# EAGLE schematic ControlBoardv1.3 (EAGLE 7.6.0)

## Sheet 1 of 6
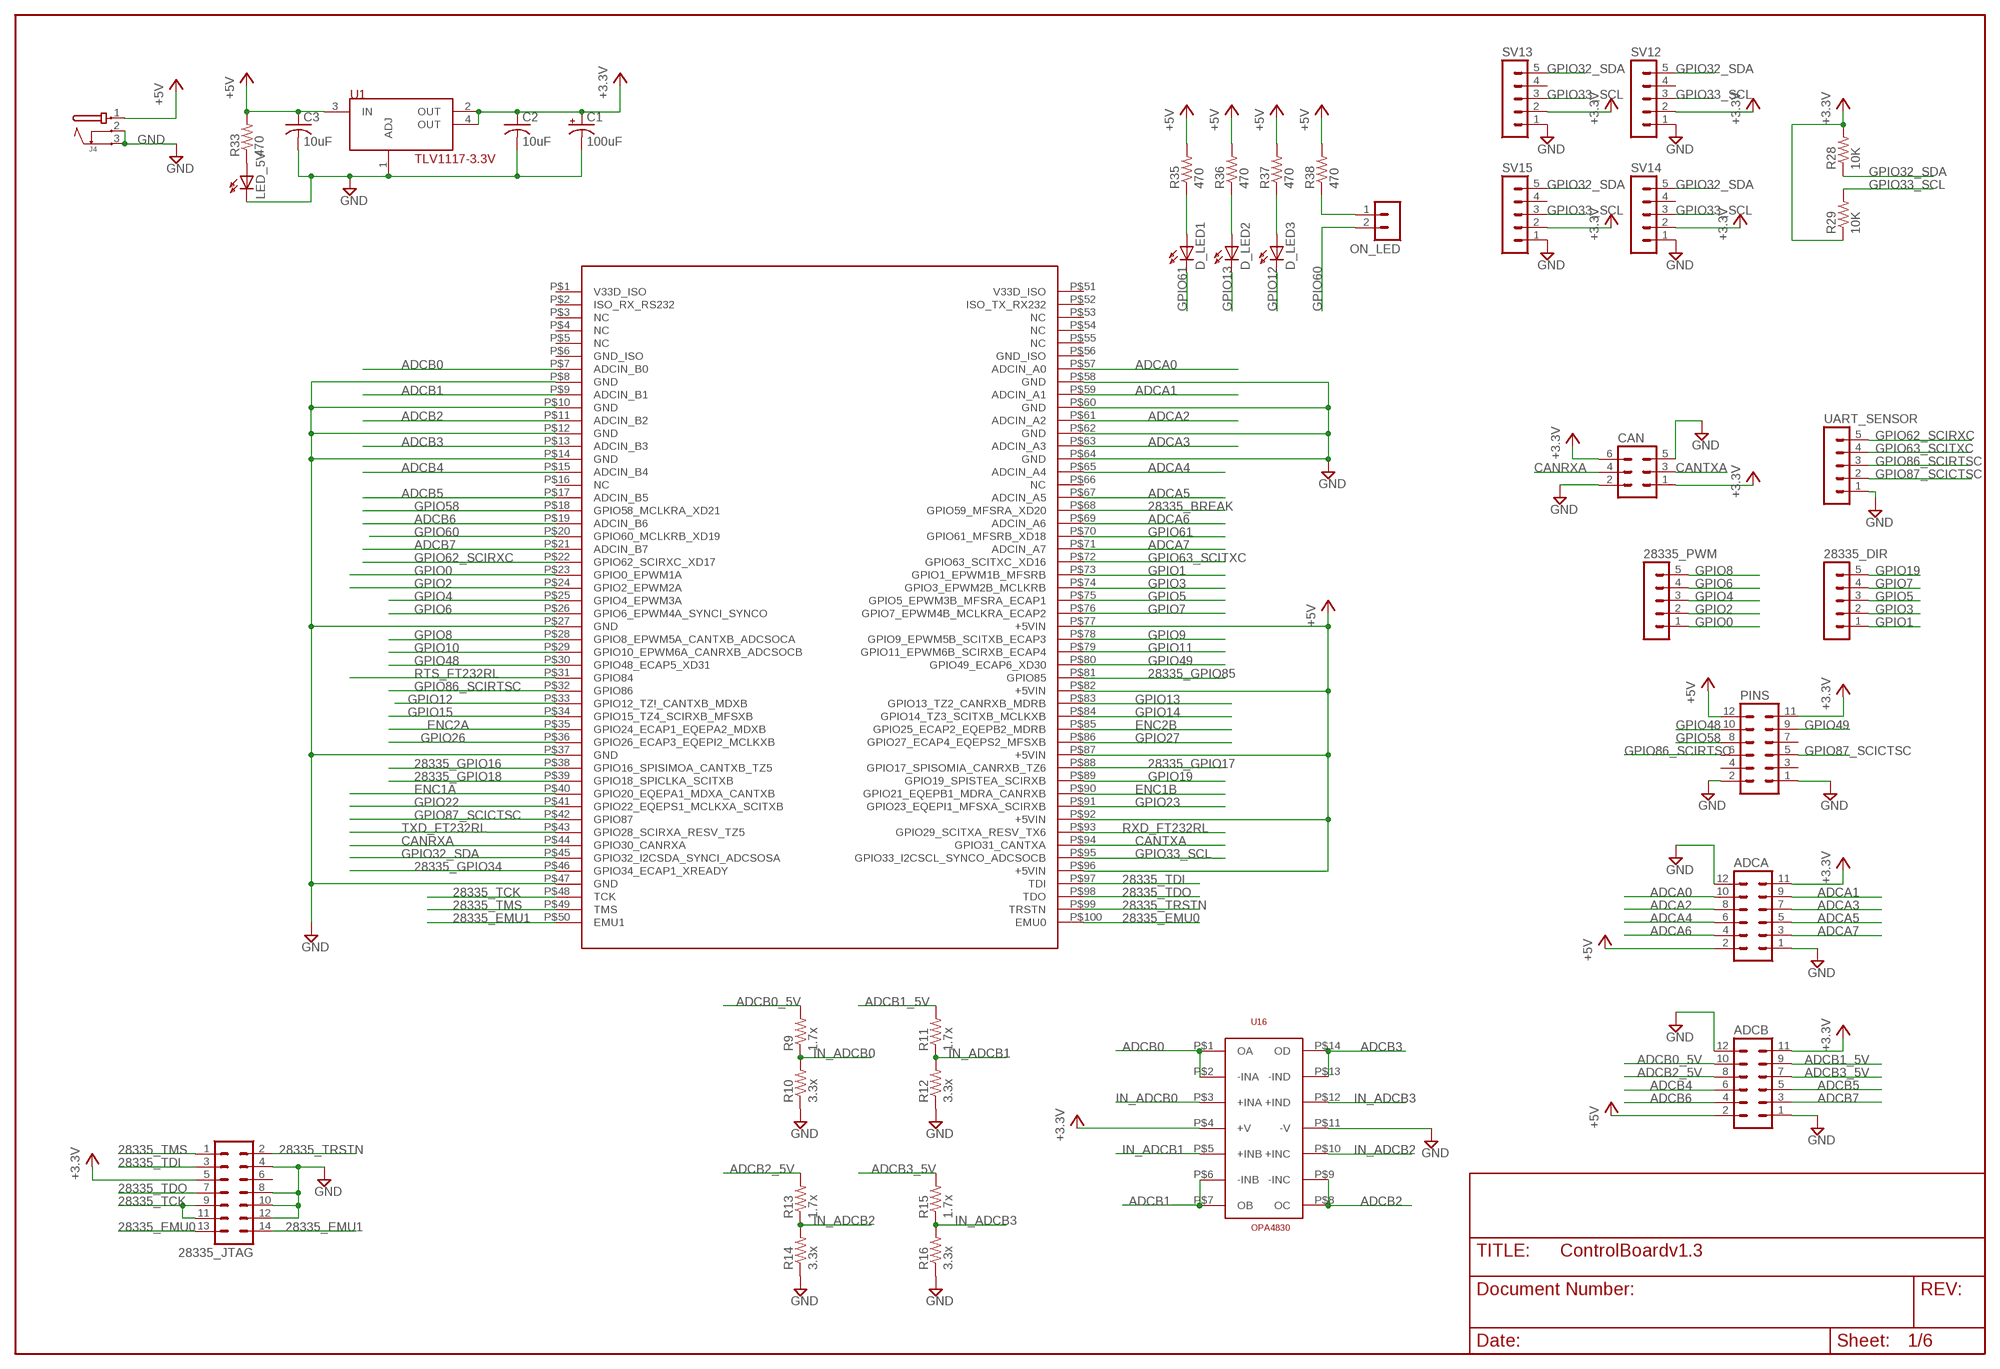
[diagram p0: schematic, sheet 1]

### Parts
28335_DIR  MA05-1  [MA05-1]
28335_JTAG  MA07-2  [MA07-2]
28335_PWM  MA05-1  [MA05-1]
ADCA  MA06-2  [MA06-2]
ADCB  MA06-2  [MA06-2]
C1  100uF  CPOL-USE3.5-8  [E3,5-8]
C2  10uF  C-USC1206  [C1206]
C3  10uF  C-USC1206  [C1206]
CAN  MA03-2  [MA03-2]
D_LED1  LED3MM  [LED3MM]
D_LED2  LED3MM  [LED3MM]
D_LED3  LED3MM  [LED3MM]
J4  JACK-PMS  [JACK-PMS]
J7  F28335_CONTROLCARD  [MOLEX_DIMM_100]
LED_5V  LED3MM  [LED3MM]
ON_LED  MA02-1  [MA02-1]
PINS  MA06-2  [MA06-2]
R9  1.7x  R-US_M1206  [M1206]
R10  3.3x  R-US_M1206  [M1206]
R11  1.7x  R-US_M1206  [M1206]
R12  3.3x  R-US_M1206  [M1206]
R13  1.7x  R-US_M1206  [M1206]
R14  3.3x  R-US_M1206  [M1206]
R15  1.7x  R-US_M1206  [M1206]
R16  3.3x  R-US_M1206  [M1206]
R28  10K  R-US_M1206  [M1206]
R29  10K  R-US_M1206  [M1206]
R33  470  R-US_M1206  [M1206]
R35  470  R-US_M1206  [M1206]
R36  470  R-US_M1206  [M1206]
R37  470  R-US_M1206  [M1206]
R38  470  R-US_M1206  [M1206]
SV12  MA05-1  [MA05-1]
SV13  MA05-1  [MA05-1]
SV14  MA05-1  [MA05-1]
SV15  MA05-1  [MA05-1]
U1  TLV1117-3.3V  TLV1117-ADJ  [SOT223]
U16  OPA4830  [OPA4830-TSSOP-14]
UART_SENSOR  MA05-1  [MA05-1]

### Nets
28335_BREAK: J7.P$68(GPIO59_MFSRA_XD20) ; also sheet 6
28335_EMU0: 28335_JTAG.13 J7.P$100(EMU0)
28335_EMU1: 28335_JTAG.14 J7.P$50(EMU1)
28335_GPIO16: J7.P$38(GPIO16_SPISIMOA_CANTXB_TZ5) ; also sheet 2,5
28335_GPIO17: J7.P$88(GPIO17_SPISOMIA_CANRXB_TZ6) ; also sheet 2,5
28335_GPIO18: J7.P$39(GPIO18_SPICLKA_SCITXB) ; also sheet 2,5
28335_GPIO34: J7.P$46(GPIO34_ECAP1_XREADY)
28335_GPIO85: J7.P$81(GPIO85) ; also sheet 2
28335_TCK: 28335_JTAG.9 28335_JTAG.11 J7.P$48(TCK)
28335_TDI: 28335_JTAG.3 J7.P$97(TDI)
28335_TDO: 28335_JTAG.7 J7.P$98(TDO)
28335_TMS: 28335_JTAG.1 J7.P$49(TMS)
28335_TRSTN: 28335_JTAG.2 J7.P$99(TRSTN)
+3.3V [supply]: 28335_JTAG.5 ADCA.11 ADCB.11 C1.+ C2.1 CAN.1 CAN.6 PINS.11 R28.2 R29.1 SV12.2 SV13.2 SV14.2 SV15.2 U1.2(OUT) U1.4(OUT) U16.P$4(+V) ; also sheet 2,4,5
+5V [supply]: ADCA.2 ADCB.2 C3.1 J4.1 J7.P$77(+5VIN) J7.P$82(+5VIN) J7.P$87(+5VIN) J7.P$92(+5VIN) J7.P$96(+5VIN) PINS.12 R33.2 R35.2 R36.2 R37.2 R38.2 U1.3(IN) ; also sheet 2,5,6
ADCA0: ADCA.10 J7.P$57(ADCIN_A0)
ADCA1: ADCA.9 J7.P$59(ADCIN_A1)
ADCA2: ADCA.8 J7.P$61(ADCIN_A2)
ADCA3: ADCA.7 J7.P$63(ADCIN_A3)
ADCA4: ADCA.6 J7.P$65(ADCIN_A4)
ADCA5: ADCA.5 J7.P$67(ADCIN_A5)
ADCA6: ADCA.4 J7.P$69(ADCIN_A6)
ADCA7: ADCA.3 J7.P$71(ADCIN_A7)
ADCB0: J7.P$7(ADCIN_B0) U16.P$1(OA) U16.P$2(-INA)
ADCB0_5V: ADCB.10 R9.2
ADCB1: J7.P$9(ADCIN_B1) U16.P$6(-INB) U16.P$7(OB)
ADCB1_5V: ADCB.9 R11.2
ADCB2: J7.P$11(ADCIN_B2) U16.P$8(OC) U16.P$9(-INC)
ADCB2_5V: ADCB.8 R13.2
ADCB3: J7.P$13(ADCIN_B3) U16.P$13(-IND) U16.P$14(OD)
ADCB3_5V: ADCB.7 R15.2
ADCB4: ADCB.6 J7.P$15(ADCIN_B4)
ADCB5: ADCB.5 J7.P$17(ADCIN_B5)
ADCB6: ADCB.4 J7.P$19(ADCIN_B6)
ADCB7: ADCB.3 J7.P$21(ADCIN_B7)
CANRXA: CAN.4 J7.P$44(GPIO30_CANRXA)
CANTXA: CAN.3 J7.P$94(GPIO31_CANTXA)
ENC1A: J7.P$40(GPIO20_EQEPA1_MDXA_CANTXB) ; also sheet 5
ENC1B: J7.P$90(GPIO21_EQEPB1_MDRA_CANRXB) ; also sheet 5
ENC2A: J7.P$35(GPIO24_ECAP1_EQEPA2_MDXB) ; also sheet 5
ENC2B: J7.P$85(GPIO25_ECAP2_EQEPB2_MDRB) ; also sheet 5
GND [supply]: 28335_JTAG.4 28335_JTAG.8 28335_JTAG.10 28335_JTAG.12 ADCA.1 ADCA.12 ADCB.1 ADCB.12 C1.- C2.2 C3.2 CAN.2 CAN.5 J4.2 J4.3 J7.P$8(GND) J7.P$10(GND) J7.P$12(GND) J7.P$14(GND) J7.P$27(GND) J7.P$37(GND) J7.P$47(GND) J7.P$58(GND) J7.P$60(GND) J7.P$62(GND) J7.P$64(GND) LED_5V.K(C) PINS.1 PINS.2 R10.1 R12.1 R14.1 R16.1 SV12.1 SV13.1 SV14.1 SV15.1 U1.1(ADJ) U16.P$11(-V) UART_SENSOR.1 ; also sheet 2,3,4,5,6
GPIO0: 28335_PWM.1 J7.P$23(GPIO0_EPWM1A)
GPIO1: 28335_DIR.1 J7.P$73(GPIO1_EPWM1B_MFSRB)
GPIO2: 28335_PWM.2 J7.P$24(GPIO2_EPWM2A)
GPIO3: 28335_DIR.2 J7.P$74(GPIO3_EPWM2B_MCLKRB)
GPIO4: 28335_PWM.3 J7.P$25(GPIO4_EPWM3A)
GPIO5: 28335_DIR.3 J7.P$75(GPIO5_EPWM3B_MFSRA_ECAP1)
GPIO6: 28335_PWM.4 J7.P$26(GPIO6_EPWM4A_SYNCI_SYNCO)
GPIO7: 28335_DIR.4 J7.P$76(GPIO7_EPWM4B_MCLKRA_ECAP2)
GPIO8: 28335_PWM.5 J7.P$28(GPIO8_EPWM5A_CANTXB_ADCSOCA)
GPIO9: J7.P$78(GPIO9_EPWM5B_SCITXB_ECAP3) ; also sheet 5
GPIO10: J7.P$29(GPIO10_EPWM6A_CANRXB_ADCSOCB) ; also sheet 5
GPIO11: J7.P$79(GPIO11_EPWM6B_SCIRXB_ECAP4) ; also sheet 5
GPIO12: D_LED3.K(C) J7.P$33(GPIO12_TZ\!_CANTXB_MDXB)
GPIO13: D_LED2.K(C) J7.P$83(GPIO13_TZ2_CANRXB_MDRB)
GPIO14: J7.P$84(GPIO14_TZ3_SCITXB_MCLKXB) ; also sheet 4
GPIO15: J7.P$34(GPIO15_TZ4_SCIRXB_MFSXB) ; also sheet 4
GPIO19: 28335_DIR.5 J7.P$89(GPIO19_SPISTEA_SCIRXB)
GPIO22: J7.P$41(GPIO22_EQEPS1_MCLKXA_SCITXB) ; also sheet 5
GPIO23: J7.P$91(GPIO23_EQEPI1_MFSXA_SCIRXB) ; also sheet 5
GPIO26: J7.P$36(GPIO26_ECAP3_EQEPI2_MCLKXB) ; also sheet 5
GPIO27: J7.P$86(GPIO27_ECAP4_EQEPS2_MFSXB) ; also sheet 5
GPIO32_SDA: J7.P$45(GPIO32_I2CSDA_SYNCI_ADCSOSA) R28.1 SV12.5 SV13.5 SV14.5 SV15.5
GPIO33_SCL: J7.P$95(GPIO33_I2CSCL_SYNCO_ADCSOCB) R29.2 SV12.3 SV13.3 SV14.3 SV15.3
GPIO48: J7.P$30(GPIO48_ECAP5_XD31) PINS.10
GPIO49: J7.P$80(GPIO49_ECAP6_XD30) PINS.9
GPIO58: J7.P$18(GPIO58_MCLKRA_XD21) PINS.8
GPIO60: J7.P$20(GPIO60_MCLKRB_XD19) ON_LED.2
GPIO61: D_LED1.K(C) J7.P$70(GPIO61_MFSRB_XD18)
GPIO62_SCIRXC: J7.P$22(GPIO62_SCIRXC_XD17) UART_SENSOR.5 ; also sheet 4
GPIO63_SCITXC: J7.P$72(GPIO63_SCITXC_XD16) UART_SENSOR.4 ; also sheet 4
GPIO86_SCIRTSC: J7.P$32(GPIO86) PINS.6 UART_SENSOR.3 ; also sheet 4
GPIO87_SCICTSC: J7.P$42(GPIO87) PINS.5 UART_SENSOR.2 ; also sheet 4
IN_ADCB0: R9.1 R10.2 U16.P$3(+INA)
IN_ADCB1: R11.1 R12.2 U16.P$5(+INB)
IN_ADCB2: R13.1 R14.2 U16.P$10(+INC)
IN_ADCB3: R15.1 R16.2 U16.P$12(+IND)
N$57: LED_5V.A R33.1
N$58: D_LED1.A R35.1
N$59: D_LED2.A R36.1
N$60: D_LED3.A R37.1
N$61: ON_LED.1 R38.1
RTS_FT232RL: J7.P$31(GPIO84) ; also sheet 3
RXD_FT232RL: J7.P$93(GPIO29_SCITXA_RESV_TX6) ; also sheet 3
TXD_FT232RL: J7.P$43(GPIO28_SCIRXA_RESV_TZ5) ; also sheet 3
Unconnected: 28335_JTAG.6 J7.P$1(V33D_ISO) J7.P$2(ISO_RX_RS232) J7.P$3(NC) J7.P$4(NC) J7.P$5(NC) J7.P$6(GND_ISO) J7.P$16(NC) J7.P$51(V33D_ISO) J7.P$52(ISO_TX_RX232) J7.P$53(NC) J7.P$54(NC) J7.P$55(NC) J7.P$56(GND_ISO) J7.P$66(NC) PINS.3 PINS.4 PINS.7 SV12.4 SV13.4 SV14.4 SV15.4

## Sheet 2 of 6
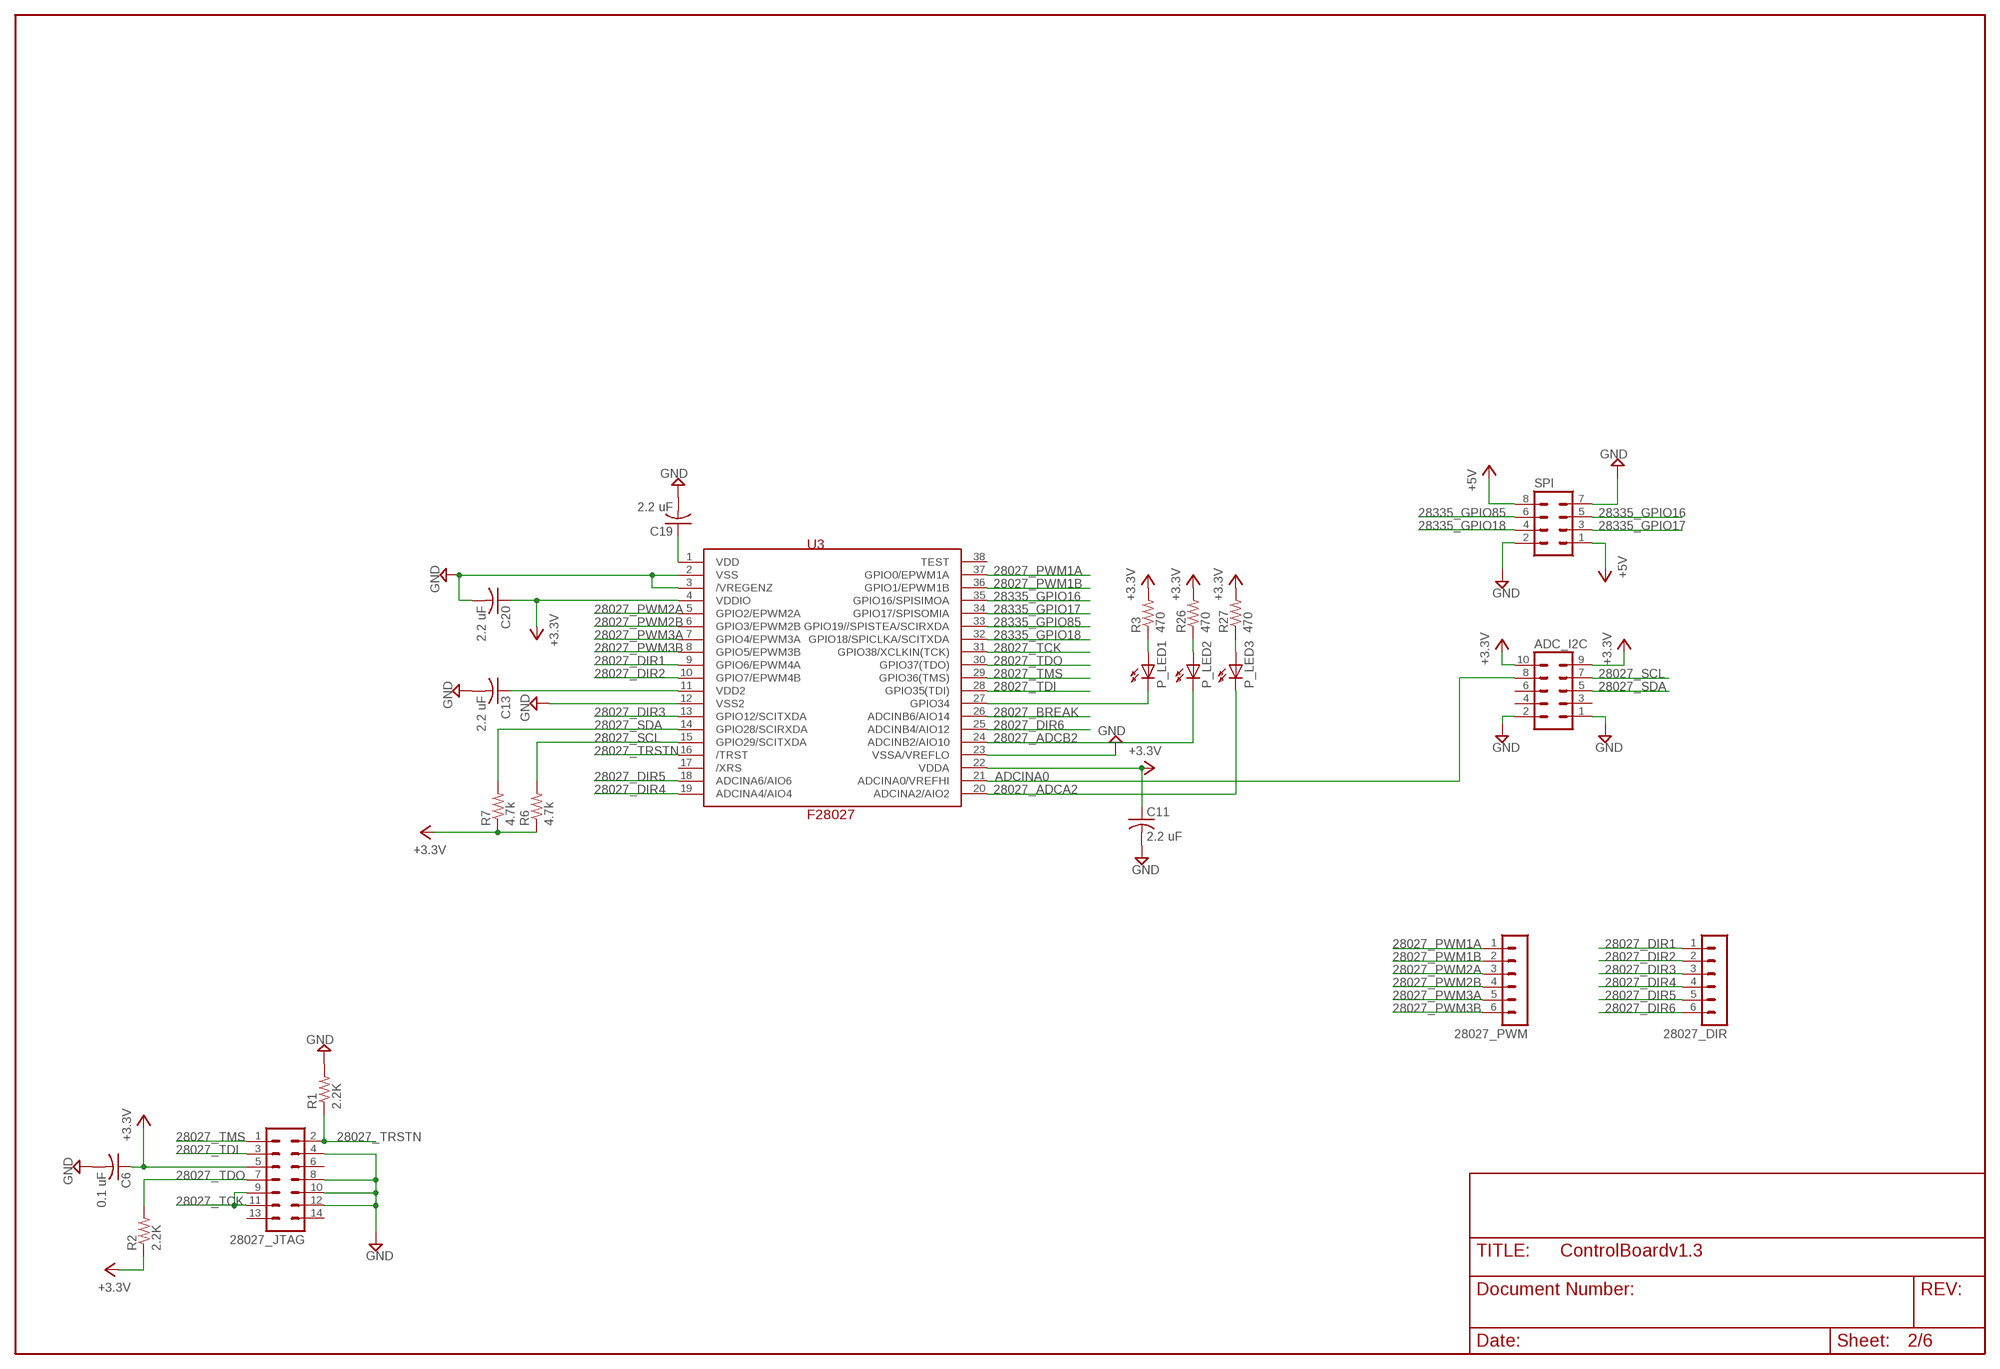
[diagram p1: schematic, sheet 2]

### Parts
28027_DIR  MA06-1  [MA06-1]
28027_JTAG  MA07-2  [MA07-2]
28027_PWM  MA06-1  [MA06-1]
ADC_I2C  MA05-2  [MA05-2]
C6  0.1 uF  C-USC1206  [C1206]
C11  2.2 uF  C-USC1206  [C1206]
C13  2.2 uF  C-USC1206  [C1206]
C19  2.2 uF  C-USC1206  [C1206]
C20  2.2 uF  C-USC1206  [C1206]
P_LED1  LED3MM  [LED3MM]
P_LED2  LED3MM  [LED3MM]
P_LED3  LED3MM  [LED3MM]
R1  2.2K  R-US_M1206  [M1206]
R2  2.2K  R-US_M1206  [M1206]
R3  470  R-US_M1206  [M1206]
R6  4.7k  R-US_M1206  [M1206]
R7  4.7k  R-US_M1206  [M1206]
R26  470  R-US_M1206  [M1206]
R27  470  R-US_M1206  [M1206]
SPI  MA04-2  [MA04-2]
U3  F28027  TMS320F28027DAS  [DA38]

### Nets
28027_ADCA2: P_LED3.K(C) U3.20(ADCINA2/AIO2)
28027_ADCB2: P_LED2.K(C) U3.24(ADCINB2/AIO10)
28027_BREAK: U3.26(ADCINB6/AIO14) ; also sheet 6
28027_DIR1: 28027_DIR.1 U3.9(GPIO6/EPWM4A)
28027_DIR2: 28027_DIR.2 U3.10(GPIO7/EPWM4B)
28027_DIR3: 28027_DIR.3 U3.13(GPIO12/SCITXDA)
28027_DIR4: 28027_DIR.4 U3.19(ADCINA4/AIO4)
28027_DIR5: 28027_DIR.5 U3.18(ADCINA6/AIO6)
28027_DIR6: 28027_DIR.6 U3.25(ADCINB4/AIO12)
28027_GPIO34: P_LED1.K(C) U3.27(GPIO34)
28027_PWM1A: 28027_PWM.1 U3.37(GPIO0/EPWM1A)
28027_PWM1B: 28027_PWM.2 U3.36(GPIO1/EPWM1B)
28027_PWM2A: 28027_PWM.3 U3.5(GPIO2/EPWM2A)
28027_PWM2B: 28027_PWM.4 U3.6(GPIO3/EPWM2B)
28027_PWM3A: 28027_PWM.5 U3.7(GPIO4/EPWM3A)
28027_PWM3B: 28027_PWM.6 U3.8(GPIO5/EPWM3B)
28027_SCL: ADC_I2C.7 R6.2 U3.15(GPIO29/SCITXDA)
28027_SDA: ADC_I2C.5 R7.2 U3.14(GPIO28/SCIRXDA)
28027_TCK: 28027_JTAG.9 28027_JTAG.11 U3.31(GPIO38/XCLKIN(TCK))
28027_TDI: 28027_JTAG.3 U3.28(GPIO35(TDI))
28027_TDO: 28027_JTAG.7 R2.2 U3.30(GPIO37(TDO))
28027_TMS: 28027_JTAG.1 U3.29(GPIO36(TMS))
28027_TRSTN: 28027_JTAG.2 R1.1 U3.16(/TRST)
28335_GPIO16: SPI.5 U3.35(GPIO16/SPISIMOA) ; also sheet 1,5
28335_GPIO17: SPI.3 U3.34(GPIO17/SPISOMIA) ; also sheet 1,5
28335_GPIO18: SPI.4 U3.32(GPIO18/SPICLKA/SCITXDA) ; also sheet 1,5
28335_GPIO85: SPI.6 U3.33(GPIO19//SPISTEA/SCIRXDA) ; also sheet 1
+3.3V [supply]: 28027_JTAG.5 ADC_I2C.9 ADC_I2C.10 C6.1 C11.1 C20.1 R2.1 R3.2 R6.1 R7.1 R26.2 R27.2 U3.4(VDDIO) U3.22(VDDA) ; also sheet 1,4,5
+5V [supply]: SPI.1 SPI.8 ; also sheet 1,5,6
ADCINA0: ADC_I2C.8 U3.21(ADCINA0/VREFHI)
GND [supply]: 28027_JTAG.4 28027_JTAG.8 28027_JTAG.10 28027_JTAG.12 ADC_I2C.1 ADC_I2C.2 C6.2 C11.2 C13.2 C19.2 C20.2 R1.2 SPI.2 SPI.7 U3.2(VSS) U3.3(/VREGENZ) U3.12(VSS2) U3.23(VSSA/VREFLO) ; also sheet 1,3,4,5,6
N$16: C19.1 U3.1(VDD)
N$17: C13.1 U3.11(VDD2)
N$18: P_LED1.A R3.1
N$35: P_LED2.A R26.1
N$37: P_LED3.A R27.1
Unconnected: 28027_JTAG.6 28027_JTAG.13 28027_JTAG.14 ADC_I2C.3 ADC_I2C.4 ADC_I2C.6 U3.17(/XRS) U3.38(TEST)

## Sheet 3 of 6
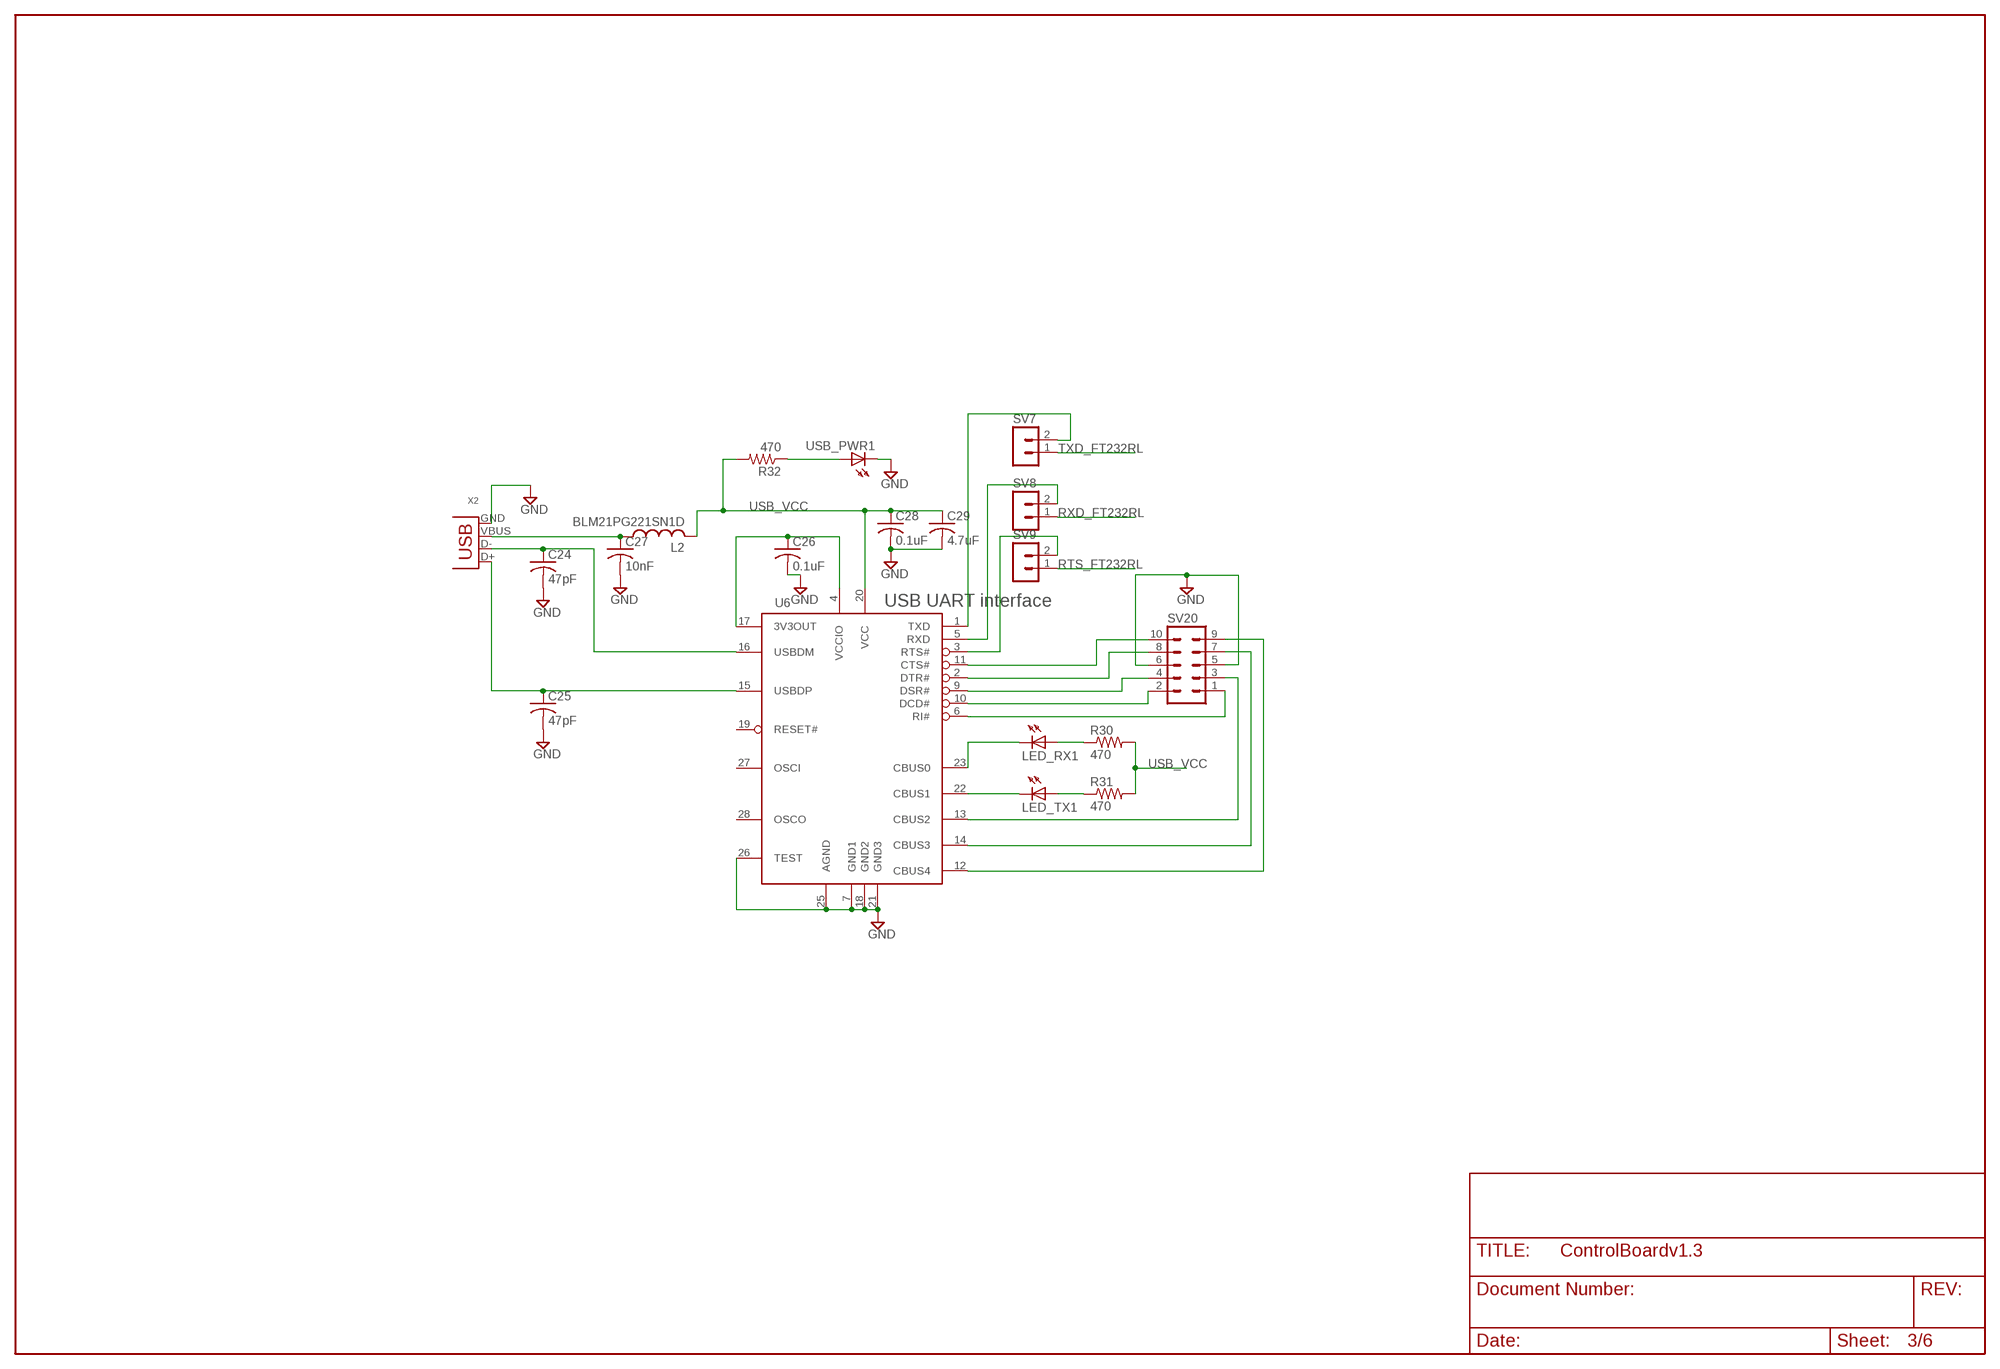
[diagram p2: schematic, sheet 3]

### Parts
C24  47pF  C-USC1206  [C1206]
C25  47pF  C-USC1206  [C1206]
C26  0.1uF  C-USC1206  [C1206]
C27  10nF  C-USC1206  [C1206]
C28  0.1uF  C-USC1206  [C1206]
C29  4.7uF  C-USC1206  [C1206]
L2  BLM21PG221SN1D  L-USL0805  [L0805]
LED_RX1  LED3MM  [LED3MM]
LED_TX1  LED3MM  [LED3MM]
R30  470  R-US_M1206  [M1206]
R31  470  R-US_M1206  [M1206]
R32  470  R-US_M1206  [M1206]
SV7  MA02-1  [MA02-1]
SV8  MA02-1  [MA02-1]
SV9  MA02-1  [MA02-1]
SV20  MA05-2  [MA05-2]
U6  FT232RL  [SSOP28DB]
USB_PWR1  LED3MM  [LED3MM]
X2  USB-B-H  [USB-B-H]

### Nets
GND [supply]: C24.2 C25.2 C26.2 C27.2 C28.2 C29.2 SV20.5 SV20.6 U6.7(GND1) U6.18(GND2) U6.21(GND3) U6.25(AGND) U6.26(TEST) USB_PWR1.K(C) X2.GND ; also sheet 1,2,4,5,6
N$25: SV7.2 U6.1(TXD)
N$31: SV8.2 U6.5(RXD)
N$33: SV9.2 U6.3(RTS#)
N$39 [supply]: C27.1 L2.1 X2.VBUS
N$40: C24.1 U6.16(USBDM) X2.D-
N$41: C25.1 U6.15(USBDP) X2.D+
N$42: C26.1 U6.4(VCCIO) U6.17(3V3OUT)
N$43: LED_TX1.K(C) U6.22(CBUS1)
N$44: LED_RX1.K(C) U6.23(CBUS0)
N$45: LED_RX1.A R30.1
N$46: LED_TX1.A R31.1
N$47: SV20.10 U6.11(CTS#)
N$48: SV20.8 U6.2(DTR#)
N$49: SV20.4 U6.9(DSR#)
N$50: SV20.2 U6.10(DCD#)
N$51: SV20.1 U6.6(RI#)
N$52: SV20.3 U6.13(CBUS2)
N$53: SV20.7 U6.14(CBUS3)
N$54: SV20.9 U6.12(CBUS4)
N$55: R32.1 USB_PWR1.A
RTS_FT232RL: SV9.1 ; also sheet 1
RXD_FT232RL: SV8.1 ; also sheet 1
TXD_FT232RL: SV7.1 ; also sheet 1
USB_VCC [supply]: C28.1 C29.1 L2.2 R30.2 R31.2 R32.2 U6.20(VCC)
Unconnected: U6.19(RESET#) U6.27(OSCI) U6.28(OSCO)

### Notes on the sheet
- USB UART interface

## Sheet 4 of 6
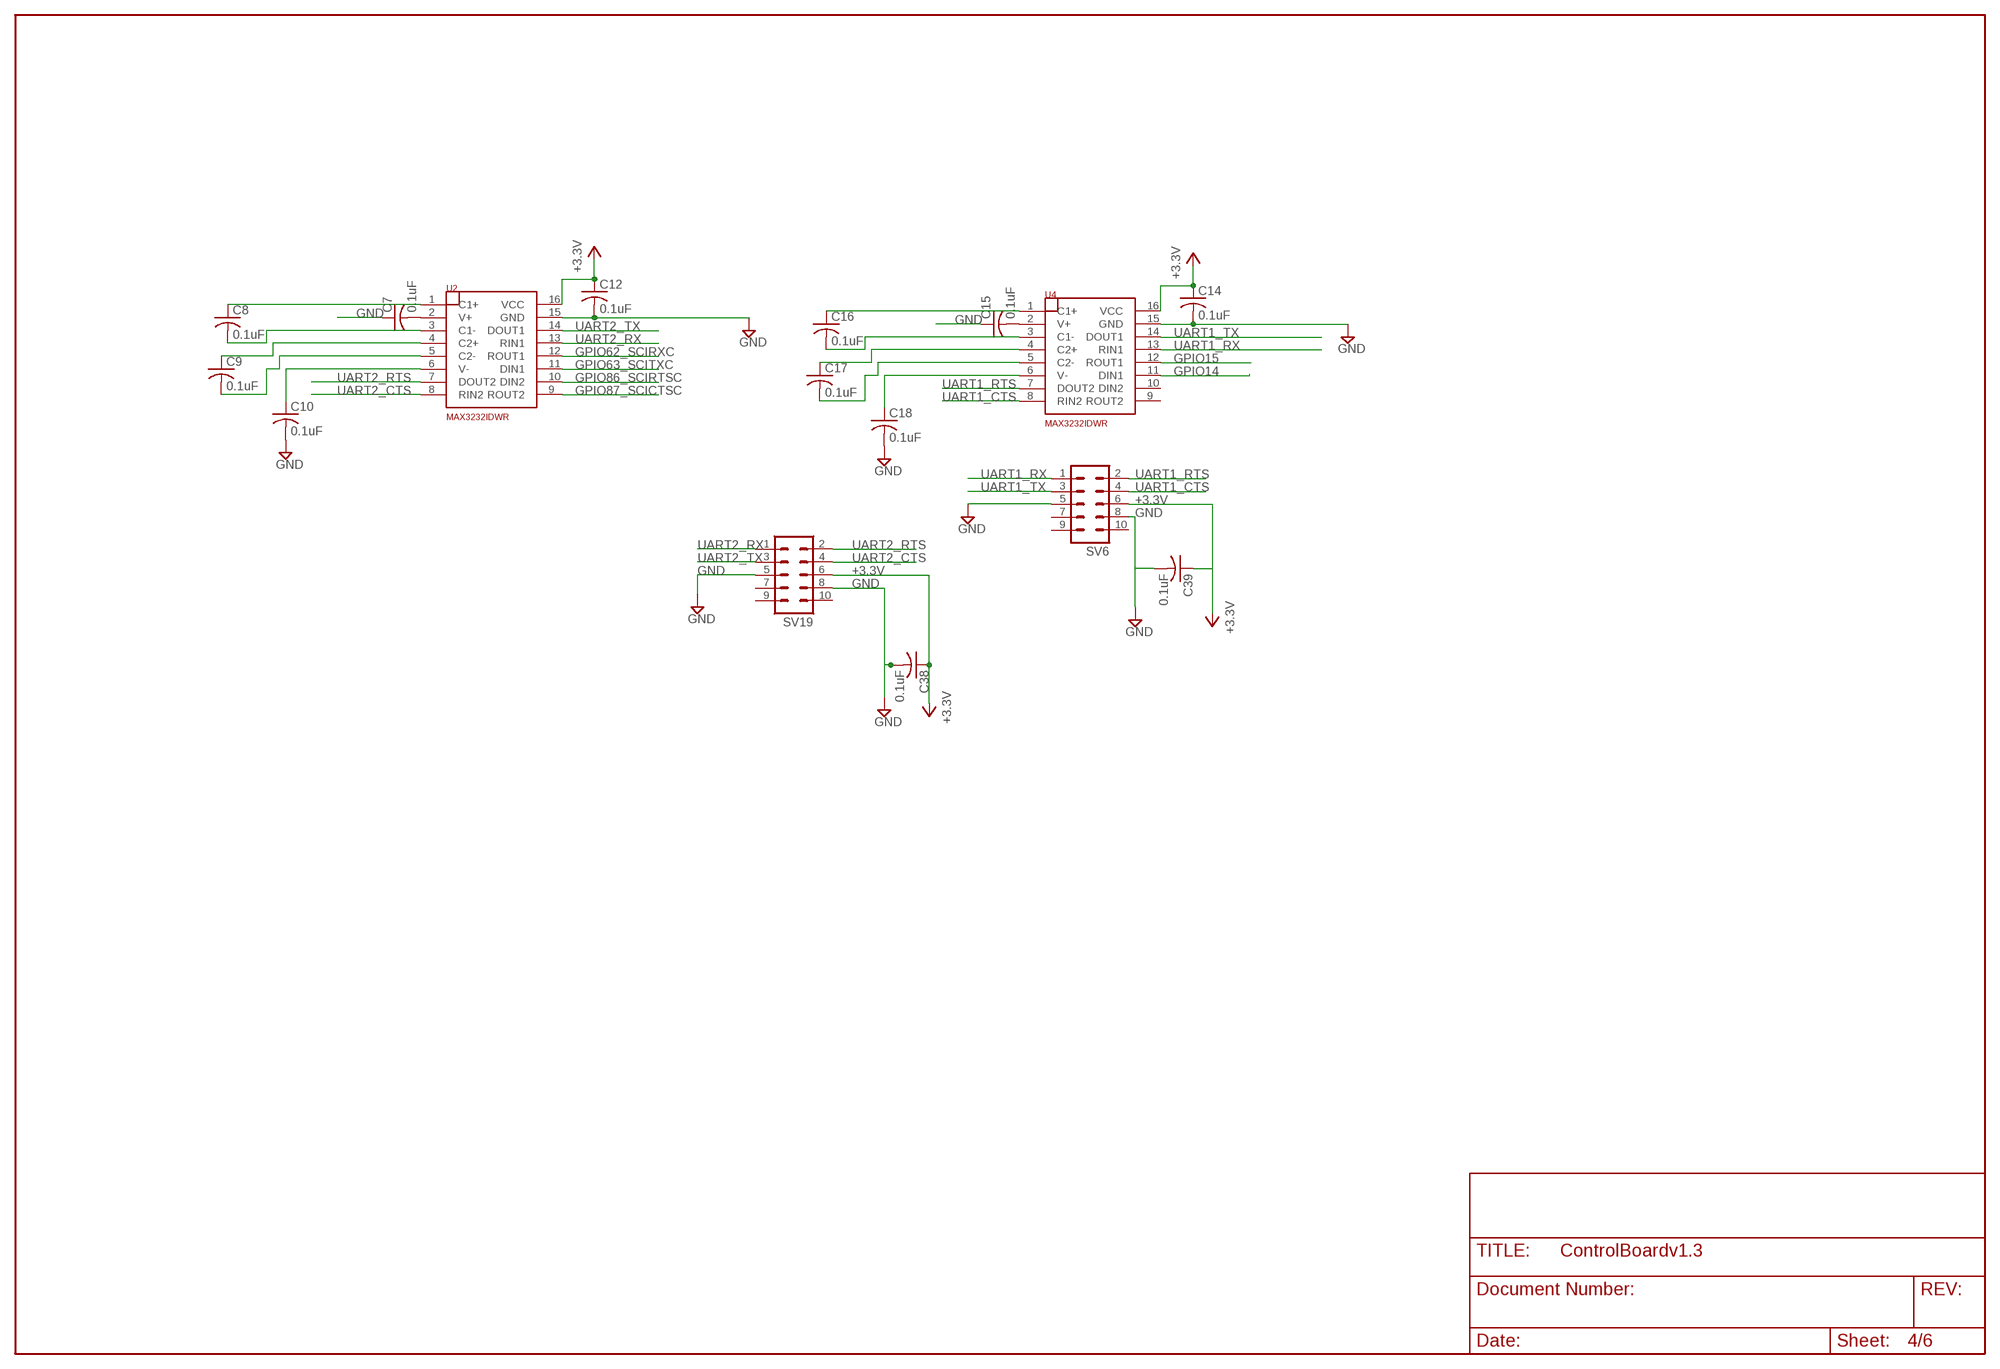
[diagram p3: schematic, sheet 4]

### Parts
C7  0.1uF  C-USC0805K  [C0805K]
C8  0.1uF  C-USC0805K  [C0805K]
C9  0.1uF  C-USC0805K  [C0805K]
C10  0.1uF  C-USC0805K  [C0805K]
C12  0.1uF  C-USC0805K  [C0805K]
C14  0.1uF  C-USC0805K  [C0805K]
C15  0.1uF  C-USC0805K  [C0805K]
C16  0.1uF  C-USC0805K  [C0805K]
C17  0.1uF  C-USC0805K  [C0805K]
C18  0.1uF  C-USC0805K  [C0805K]
C38  0.1uF  C-USC0805K  [C0805K]
C39  0.1uF  C-USC0805K  [C0805K]
SV6  MA05-2  [MA05-2]
SV19  MA05-2  [MA05-2]
U2  MAX3232IDWR  [SO16W]
U4  MAX3232IDWR  [SO16W]

### Nets
+3.3V [supply]: C12.1 C14.1 C38.1 C39.1 SV6.6 SV19.6 U2.16(VCC) U4.16(VCC) ; also sheet 1,2,5
GND [supply]: C7.1 C10.2 C12.2 C14.2 C15.1 C18.2 C38.2 C39.2 SV6.5 SV6.8 SV19.5 SV19.8 U2.15(GND) U4.15(GND) ; also sheet 1,2,3,5,6
GPIO14: U4.11(DIN1) ; also sheet 1
GPIO15: U4.12(ROUT1) ; also sheet 1
GPIO62_SCIRXC: U2.12(ROUT1) ; also sheet 1
GPIO63_SCITXC: U2.11(DIN1) ; also sheet 1
GPIO86_SCIRTSC: U2.10(DIN2) ; also sheet 1
GPIO87_SCICTSC: U2.9(ROUT2) ; also sheet 1
N$20: C7.2 U2.2(V+)
N$21: C16.1 U4.1(C1+)
N$22: C16.2 U4.3(C1-)
N$23: C17.1 U4.4(C2+)
N$24: C17.2 U4.5(C2-)
N$26: C18.1 U4.6(V-)
N$27: C15.2 U4.2(V+)
N$71: C8.1 U2.1(C1+)
N$72: C8.2 U2.3(C1-)
N$74: C9.1 U2.4(C2+)
N$75: C9.2 U2.5(C2-)
N$76: C10.1 U2.6(V-)
UART1_CTS: SV6.4 U4.8(RIN2)
UART1_RTS: SV6.2 U4.7(DOUT2)
UART1_RX: SV6.1 U4.13(RIN1)
UART1_TX: SV6.3 U4.14(DOUT1)
UART2_CTS: SV19.4 U2.8(RIN2)
UART2_RTS: SV19.2 U2.7(DOUT2)
UART2_RX: SV19.1 U2.13(RIN1)
UART2_TX: SV19.3 U2.14(DOUT1)
Unconnected: SV6.7 SV6.9 SV6.10 SV19.7 SV19.9 SV19.10 U4.9(ROUT2) U4.10(DIN2)

## Sheet 5 of 6
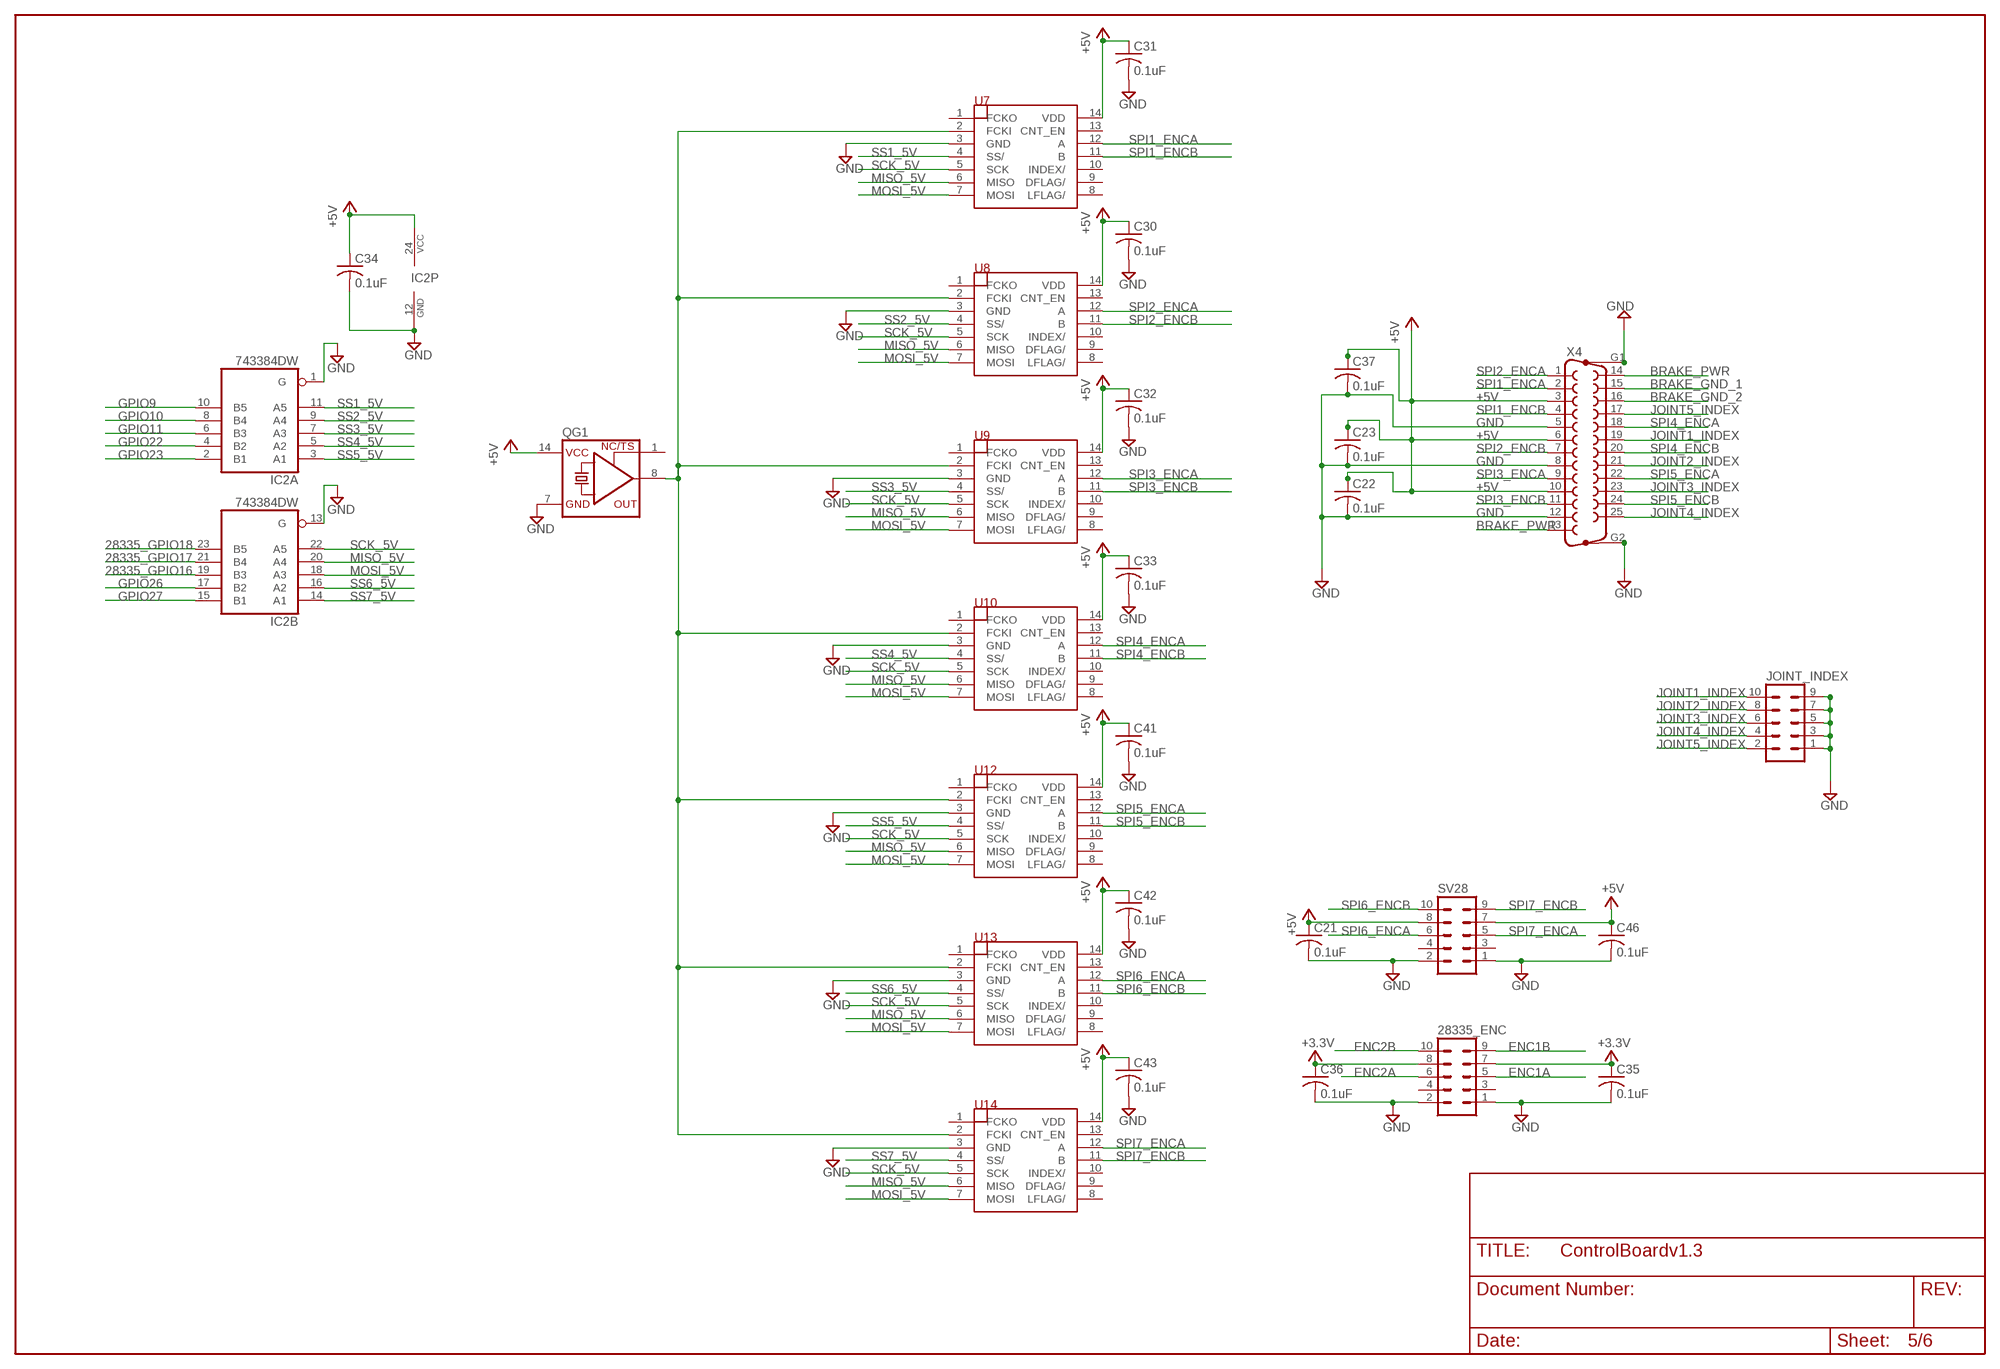
[diagram p4: schematic, sheet 5]

### Parts
28335_ENC  MA05-2  [MA05-2]
C21  0.1uF  C-USC1206  [C1206]
C22  0.1uF  C-USC1206  [C1206]
C23  0.1uF  C-USC1206  [C1206]
C30  0.1uF  C-USC1206  [C1206]
C31  0.1uF  C-USC1206  [C1206]
C32  0.1uF  C-USC1206  [C1206]
C33  0.1uF  C-USC1206  [C1206]
C34  0.1uF  C-USC1206  [C1206]
C35  0.1uF  C-USC1206  [C1206]
C36  0.1uF  C-USC1206  [C1206]
C37  0.1uF  C-USC1206  [C1206]
C41  0.1uF  C-USC1206  [C1206]
C42  0.1uF  C-USC1206  [C1206]
C43  0.1uF  C-USC1206  [C1206]
C46  0.1uF  C-USC1206  [C1206]
IC2  743384DW  [SO24W]
JOINT_INDEX  MA05-2  [MA05-2]
QG1  XO-14  [DIL14S]
SV28  MA05-2  [MA05-2]
U7  LS7366R  [SO14]
U8  LS7366R  [SO14]
U9  LS7366R  [SO14]
U10  LS7366R  [SO14]
U12  LS7366R  [SO14]
U13  LS7366R  [SO14]
U14  LS7366R  [SO14]
X4  F25HP  [F25HP]

### Nets
28335_GPIO16: IC2.19(B:B3) ; also sheet 1,2
28335_GPIO17: IC2.21(B:B4) ; also sheet 1,2
28335_GPIO18: IC2.23(B:B5) ; also sheet 1,2
+3.3V [supply]: 28335_ENC.7 28335_ENC.8 C35.1 C36.1 ; also sheet 1,2,4
+5V [supply]: C21.1 C22.1 C23.1 C30.1 C31.1 C32.1 C33.1 C34.1 C37.1 C41.1 C42.1 C43.1 C46.1 IC2.24(P:VCC) QG1.14(VCC) SV28.7 SV28.8 U7.14(VDD) U8.14(VDD) U9.14(VDD) U10.14(VDD) U12.14(VDD) U13.14(VDD) U14.14(VDD) X4.3 X4.6 X4.10 ; also sheet 1,2,6
BRAKE_GND_1: X4.15 ; also sheet 6
BRAKE_GND_2: X4.16 ; also sheet 6
BRAKE_PWR: X4.13 X4.14 ; also sheet 6
ENC1A: 28335_ENC.5 ; also sheet 1
ENC1B: 28335_ENC.9 ; also sheet 1
ENC2A: 28335_ENC.6 ; also sheet 1
ENC2B: 28335_ENC.10 ; also sheet 1
GND [supply]: 28335_ENC.1 28335_ENC.2 C21.2 C22.2 C23.2 C30.2 C31.2 C32.2 C33.2 C34.2 C35.2 C36.2 C37.2 C41.2 C42.2 C43.2 C46.2 IC2.1(A:G) IC2.12(P:GND) IC2.13(B:G) JOINT_INDEX.1 JOINT_INDEX.3 JOINT_INDEX.5 JOINT_INDEX.7 JOINT_INDEX.9 QG1.7(GND) SV28.1 SV28.2 U7.3(GND) U8.3(GND) U9.3(GND) U10.3(GND) U12.3(GND) U13.3(GND) U14.3(GND) X4.5 X4.8 X4.12 X4.G1 X4.G2 ; also sheet 1,2,3,4,6
GPIO9: IC2.10(A:B5) ; also sheet 1
GPIO10: IC2.8(A:B4) ; also sheet 1
GPIO11: IC2.6(A:B3) ; also sheet 1
GPIO22: IC2.4(A:B2) ; also sheet 1
GPIO23: IC2.2(A:B1) ; also sheet 1
GPIO26: IC2.17(B:B2) ; also sheet 1
GPIO27: IC2.15(B:B1) ; also sheet 1
JOINT1_INDEX: JOINT_INDEX.10 X4.19
JOINT2_INDEX: JOINT_INDEX.8 X4.21
JOINT3_INDEX: JOINT_INDEX.6 X4.23
JOINT4_INDEX: JOINT_INDEX.4 X4.25
JOINT5_INDEX: JOINT_INDEX.2 X4.17
MISO_5V: IC2.20(B:A4) U7.6(MISO) U8.6(MISO) U9.6(MISO) U10.6(MISO) U12.6(MISO) U13.6(MISO) U14.6(MISO)
MOSI_5V: IC2.18(B:A3) U7.7(MOSI) U8.7(MOSI) U9.7(MOSI) U10.7(MOSI) U12.7(MOSI) U13.7(MOSI) U14.7(MOSI)
N$56: QG1.8(OUT) U7.2(FCKI) U8.2(FCKI) U9.2(FCKI) U10.2(FCKI) U12.2(FCKI) U13.2(FCKI) U14.2(FCKI)
SCK_5V: IC2.22(B:A5) U7.5(SCK) U8.5(SCK) U9.5(SCK) U10.5(SCK) U12.5(SCK) U13.5(SCK) U14.5(SCK)
SPI1_ENCA: U7.12(A) X4.2
SPI1_ENCB: U7.11(B) X4.4
SPI2_ENCA: U8.12(A) X4.1
SPI2_ENCB: U8.11(B) X4.7
SPI3_ENCA: U9.12(A) X4.9
SPI3_ENCB: U9.11(B) X4.11
SPI4_ENCA: U10.12(A) X4.18
SPI4_ENCB: U10.11(B) X4.20
SPI5_ENCA: U12.12(A) X4.22
SPI5_ENCB: U12.11(B) X4.24
SPI6_ENCA: SV28.6 U13.12(A)
SPI6_ENCB: SV28.10 U13.11(B)
SPI7_ENCA: SV28.5 U14.12(A)
SPI7_ENCB: SV28.9 U14.11(B)
SS1_5V: IC2.11(A:A5) U7.4(SS/)
SS2_5V: IC2.9(A:A4) U8.4(SS/)
SS3_5V: IC2.7(A:A3) U9.4(SS/)
SS4_5V: IC2.5(A:A2) U10.4(SS/)
SS5_5V: IC2.3(A:A1) U12.4(SS/)
SS6_5V: IC2.16(B:A2) U13.4(SS/)
SS7_5V: IC2.14(B:A1) U14.4(SS/)
Unconnected: 28335_ENC.3 28335_ENC.4 QG1.1(TS) SV28.3 SV28.4 U7.1(FCKO) U7.8(LFLAG/) U7.9(DFLAG/) U7.10(INDEX/) U7.13(CNT_EN) U8.1(FCKO) U8.8(LFLAG/) U8.9(DFLAG/) U8.10(INDEX/) U8.13(CNT_EN) U9.1(FCKO) U9.8(LFLAG/) U9.9(DFLAG/) U9.10(INDEX/) U9.13(CNT_EN) U10.1(FCKO) U10.8(LFLAG/) U10.9(DFLAG/) U10.10(INDEX/) U10.13(CNT_EN) U12.1(FCKO) U12.8(LFLAG/) U12.9(DFLAG/) U12.10(INDEX/) U12.13(CNT_EN) U13.1(FCKO) U13.8(LFLAG/) U13.9(DFLAG/) U13.10(INDEX/) U13.13(CNT_EN) U14.1(FCKO) U14.8(LFLAG/) U14.9(DFLAG/) U14.10(INDEX/) U14.13(CNT_EN)

## Sheet 6 of 6
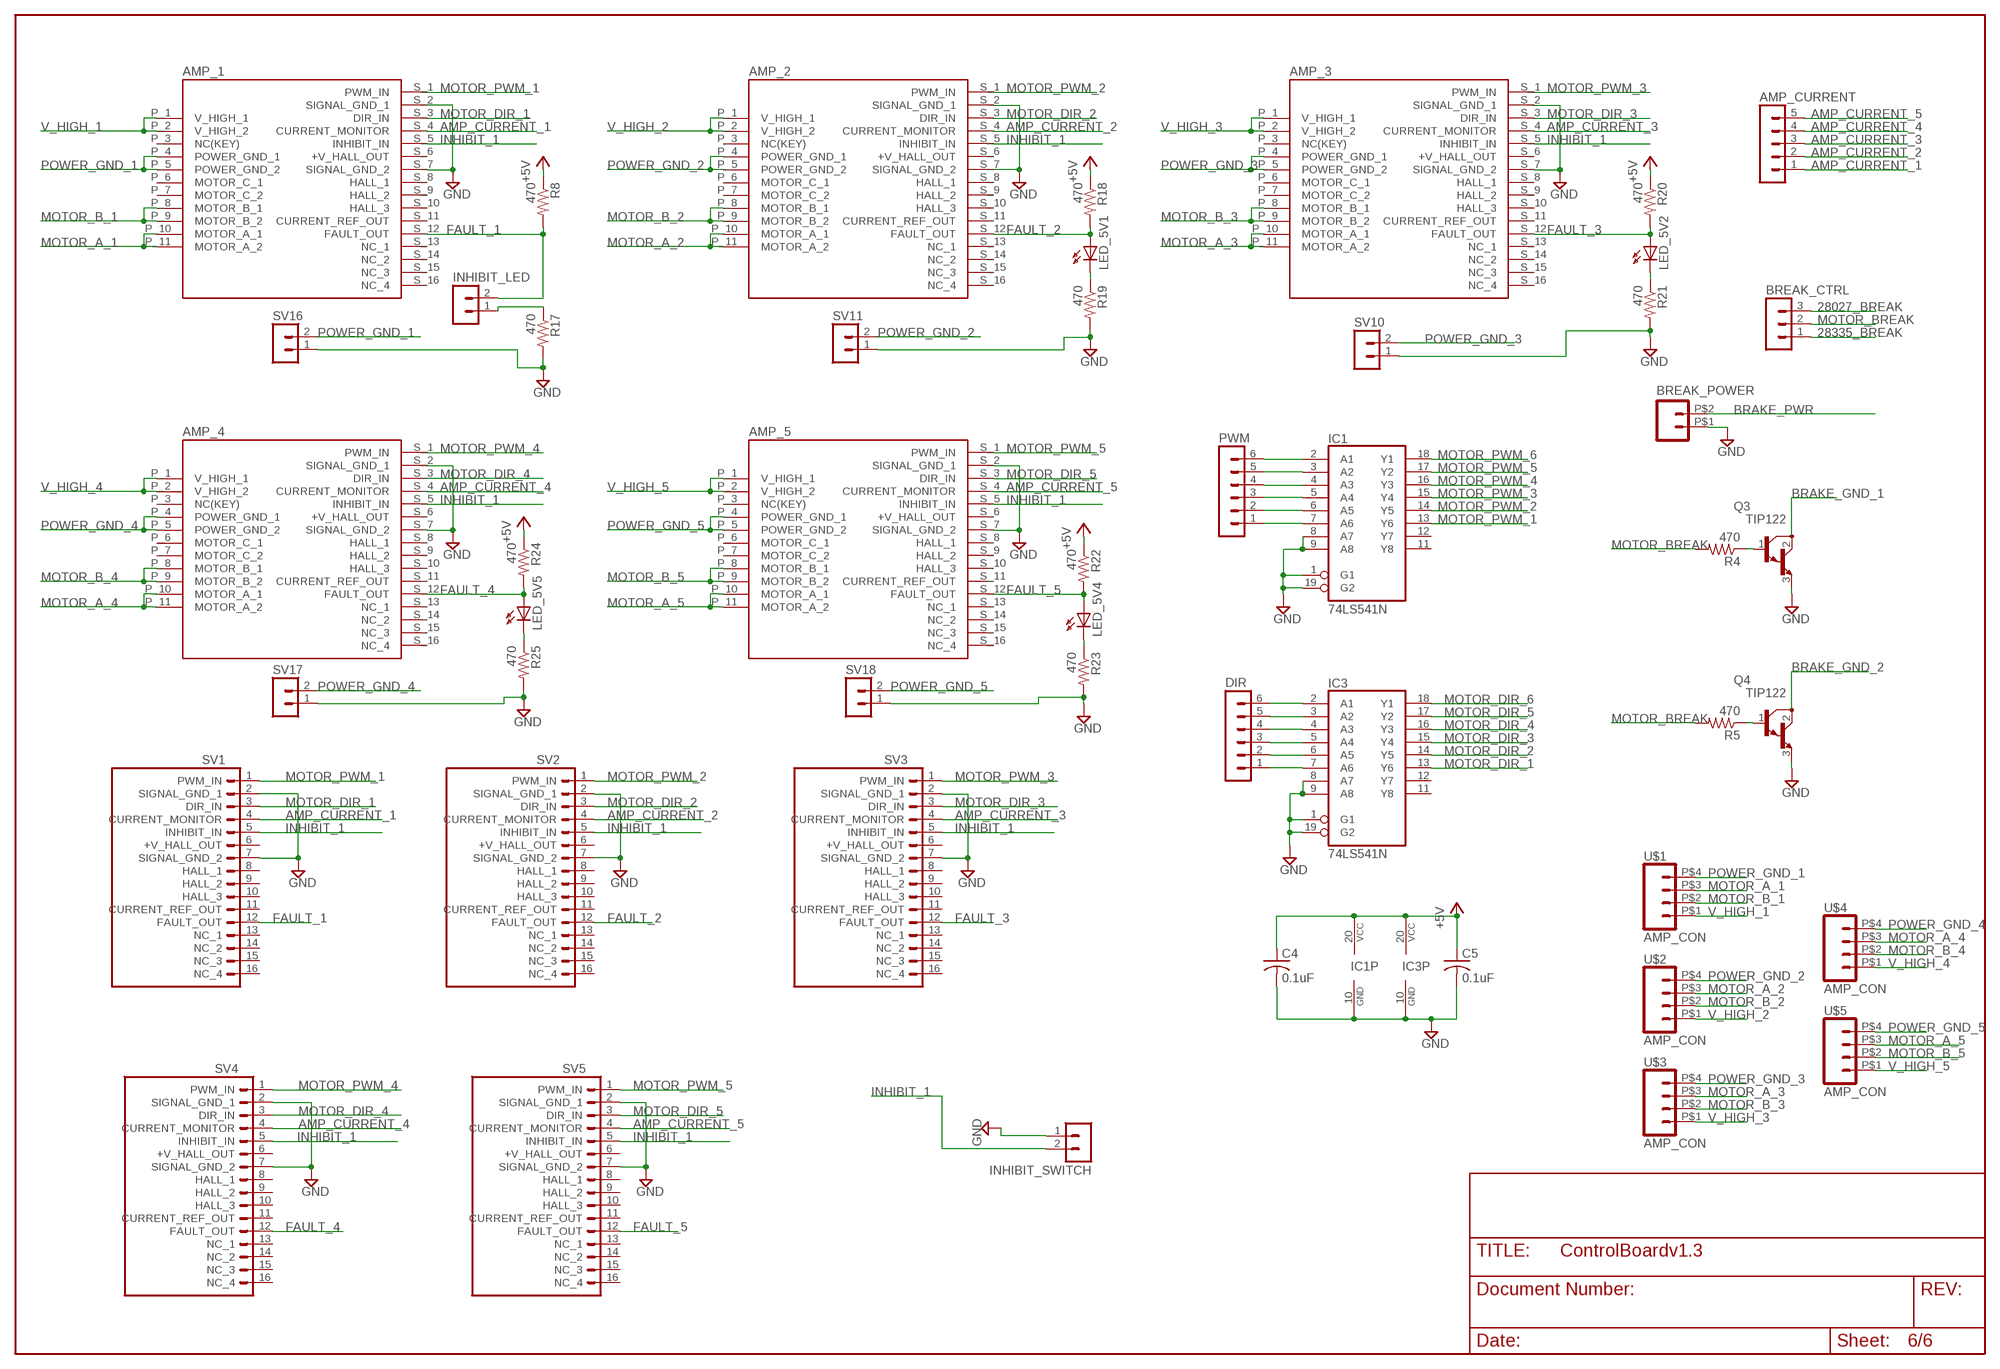
[diagram p5: schematic, sheet 6]

### Parts
AMP_1  AZBDC12A8THROUGH_HOLE  [AZBDC12A8]
AMP_2  AZBDC12A8THROUGH_HOLE  [AZBDC12A8]
AMP_3  AZBDC12A8THROUGH_HOLE  [AZBDC12A8]
AMP_4  AZBDC12A8THROUGH_HOLE  [AZBDC12A8]
AMP_5  AZBDC12A8THROUGH_HOLE  [AZBDC12A8]
AMP_CURRENT  MA05-1  [MA05-1]
BREAK_CTRL  MA03-1  [MA03-1]
BREAK_POWER  BREAK_POWER_CON  [BREAK_POWER_CON]
C4  0.1uF  C-USC1206  [C1206]
C5  0.1uF  C-USC1206  [C1206]
DIR  MA06-1  [MA06-1]
IC1  74LS541N  [DIL20]
IC3  74LS541N  [DIL20]
INHIBIT_LED  MA02-1  [MA02-1]
INHIBIT_SWITCH  MA02-1  [MA02-1]
LED_5V1  LED3MM  [LED3MM]
LED_5V2  LED3MM  [LED3MM]
LED_5V4  LED3MM  [LED3MM]
LED_5V5  LED3MM  [LED3MM]
PWM  MA06-1  [MA06-1]
Q3  TIP122  [TO220]
Q4  TIP122  [TO220]
R4  470  R-US_M1206  [M1206]
R5  470  R-US_M1206  [M1206]
R8  470  R-US_M1206  [M1206]
R17  470  R-US_M1206  [M1206]
R18  470  R-US_M1206  [M1206]
R19  470  R-US_M1206  [M1206]
R20  470  R-US_M1206  [M1206]
R21  470  R-US_M1206  [M1206]
R22  470  R-US_M1206  [M1206]
R23  470  R-US_M1206  [M1206]
R24  470  R-US_M1206  [M1206]
R25  470  R-US_M1206  [M1206]
SV1  AMP_HEADER  [AMP_HEADER]
SV2  AMP_HEADER  [AMP_HEADER]
SV3  AMP_HEADER  [AMP_HEADER]
SV4  AMP_HEADER  [AMP_HEADER]
SV5  AMP_HEADER  [AMP_HEADER]
SV10  MA02-1  [MA02-1]
SV11  MA02-1  [MA02-1]
SV16  MA02-1  [MA02-1]
SV17  MA02-1  [MA02-1]
SV18  MA02-1  [MA02-1]
U$1  AMP_CON  [APM_CON]
U$2  AMP_CON  [APM_CON]
U$3  AMP_CON  [APM_CON]
U$4  AMP_CON  [APM_CON]
U$5  AMP_CON  [APM_CON]

### Nets
28027_BREAK: BREAK_CTRL.3 ; also sheet 2
28335_BREAK: BREAK_CTRL.1 ; also sheet 1
+5V [supply]: C4.1 C5.1 IC1.20(VCC) IC3.20(VCC) R8.1 R18.1 R20.1 R22.1 R24.1 ; also sheet 1,2,5
AMP_CURRENT_1: AMP_1.S_4(CURRENT_MONITOR) AMP_CURRENT.1 SV1.4(CURRENT_MONITOR)
AMP_CURRENT_2: AMP_2.S_4(CURRENT_MONITOR) AMP_CURRENT.2 SV2.4(CURRENT_MONITOR)
AMP_CURRENT_3: AMP_3.S_4(CURRENT_MONITOR) AMP_CURRENT.3 SV3.4(CURRENT_MONITOR)
AMP_CURRENT_4: AMP_4.S_4(CURRENT_MONITOR) AMP_CURRENT.4 SV4.4(CURRENT_MONITOR)
AMP_CURRENT_5: AMP_5.S_4(CURRENT_MONITOR) AMP_CURRENT.5 SV5.4(CURRENT_MONITOR)
BRAKE_GND_1: Q3.2(C) ; also sheet 5
BRAKE_GND_2: Q4.2(C) ; also sheet 5
BRAKE_PWR: BREAK_POWER.P$2 ; also sheet 5
FAULT_1: AMP_1.S_12(FAULT_OUT) INHIBIT_LED.2 R8.2 SV1.12(FAULT_OUT)
FAULT_2: AMP_2.S_12(FAULT_OUT) LED_5V1.A R18.2 SV2.12(FAULT_OUT)
FAULT_3: AMP_3.S_12(FAULT_OUT) LED_5V2.A R20.2 SV3.12(FAULT_OUT)
FAULT_4: AMP_4.S_12(FAULT_OUT) LED_5V5.A R24.2 SV4.12(FAULT_OUT)
FAULT_5: AMP_5.S_12(FAULT_OUT) LED_5V4.A R22.2 SV5.12(FAULT_OUT)
GND [supply]: AMP_1.S_2(SIGNAL_GND_1) AMP_1.S_7(SIGNAL_GND_2) AMP_2.S_2(SIGNAL_GND_1) AMP_2.S_7(SIGNAL_GND_2) AMP_3.S_2(SIGNAL_GND_1) AMP_3.S_7(SIGNAL_GND_2) AMP_4.S_2(SIGNAL_GND_1) AMP_4.S_7(SIGNAL_GND_2) AMP_5.S_2(SIGNAL_GND_1) AMP_5.S_7(SIGNAL_GND_2) BREAK_POWER.P$1 C4.2 C5.2 IC1.1(G1) IC1.8(A7) IC1.9(A8) IC1.10(GND) IC1.19(G2) IC3.1(G1) IC3.8(A7) IC3.9(A8) IC3.10(GND) IC3.19(G2) INHIBIT_SWITCH.1 Q3.3(E) Q4.3(E) R17.2 R19.2 R21.2 R23.2 R25.2 SV1.2(SIGNAL_GND_1) SV1.7(SIGNAL_GND_2) SV2.2(SIGNAL_GND_1) SV2.7(SIGNAL_GND_2) SV3.2(SIGNAL_GND_1) SV3.7(SIGNAL_GND_2) SV4.2(SIGNAL_GND_1) SV4.7(SIGNAL_GND_2) SV5.2(SIGNAL_GND_1) SV5.7(SIGNAL_GND_2) SV10.1 SV11.1 SV16.1 SV17.1 SV18.1 ; also sheet 1,2,3,4,5
INHIBIT_1: AMP_1.S_5(INHIBIT_IN) AMP_2.S_5(INHIBIT_IN) AMP_3.S_5(INHIBIT_IN) AMP_4.S_5(INHIBIT_IN) AMP_5.S_5(INHIBIT_IN) INHIBIT_SWITCH.2 SV1.5(INHIBIT_IN) SV2.5(INHIBIT_IN) SV3.5(INHIBIT_IN) SV4.5(INHIBIT_IN) SV5.5(INHIBIT_IN)
MOTOR_A_1: AMP_1.P_10(MOTOR_A_1) AMP_1.P_11(MOTOR_A_2) U$1.P$3
MOTOR_A_2: AMP_2.P_10(MOTOR_A_1) AMP_2.P_11(MOTOR_A_2) U$2.P$3
MOTOR_A_3: AMP_3.P_10(MOTOR_A_1) AMP_3.P_11(MOTOR_A_2) U$3.P$3
MOTOR_A_4: AMP_4.P_10(MOTOR_A_1) AMP_4.P_11(MOTOR_A_2) U$4.P$3
MOTOR_A_5: AMP_5.P_10(MOTOR_A_1) AMP_5.P_11(MOTOR_A_2) U$5.P$3
MOTOR_B_1: AMP_1.P_8(MOTOR_B_1) AMP_1.P_9(MOTOR_B_2) U$1.P$2
MOTOR_B_2: AMP_2.P_8(MOTOR_B_1) AMP_2.P_9(MOTOR_B_2) U$2.P$2
MOTOR_B_3: AMP_3.P_8(MOTOR_B_1) AMP_3.P_9(MOTOR_B_2) U$3.P$2
MOTOR_B_4: AMP_4.P_8(MOTOR_B_1) AMP_4.P_9(MOTOR_B_2) U$4.P$2
MOTOR_B_5: AMP_5.P_8(MOTOR_B_1) AMP_5.P_9(MOTOR_B_2) U$5.P$2
MOTOR_BREAK: BREAK_CTRL.2 R4.2 R5.2
MOTOR_DIR_1: AMP_1.S_3(DIR_IN) IC3.13(Y6) SV1.3(DIR_IN)
MOTOR_DIR_2: AMP_2.S_3(DIR_IN) IC3.14(Y5) SV2.3(DIR_IN)
MOTOR_DIR_3: AMP_3.S_3(DIR_IN) IC3.15(Y4) SV3.3(DIR_IN)
MOTOR_DIR_4: AMP_4.S_3(DIR_IN) IC3.16(Y3) SV4.3(DIR_IN)
MOTOR_DIR_5: AMP_5.S_3(DIR_IN) IC3.17(Y2) SV5.3(DIR_IN)
MOTOR_DIR_6: IC3.18(Y1)
MOTOR_PWM_1: AMP_1.S_1(PWM_IN) IC1.13(Y6) SV1.1(PWM_IN)
MOTOR_PWM_2: AMP_2.S_1(PWM_IN) IC1.14(Y5) SV2.1(PWM_IN)
MOTOR_PWM_3: AMP_3.S_1(PWM_IN) IC1.15(Y4) SV3.1(PWM_IN)
MOTOR_PWM_4: AMP_4.S_1(PWM_IN) IC1.16(Y3) SV4.1(PWM_IN)
MOTOR_PWM_5: AMP_5.S_1(PWM_IN) IC1.17(Y2) SV5.1(PWM_IN)
MOTOR_PWM_6: IC1.18(Y1)
N$1: IC1.7(A6) PWM.1
N$2: IC1.6(A5) PWM.2
N$3: DIR.1 IC3.7(A6)
N$4: Q3.1(B) R4.1
N$5: DIR.2 IC3.6(A5)
N$6: DIR.3 IC3.5(A4)
N$7: DIR.4 IC3.4(A3)
N$8: IC1.5(A4) PWM.3
N$9: IC1.4(A3) PWM.4
N$10: IC1.3(A2) PWM.5
N$11: IC1.2(A1) PWM.6
N$13: INHIBIT_LED.1 R17.1
N$19: Q4.1(B) R5.1
N$28: DIR.6 IC3.2(A1)
N$29: DIR.5 IC3.3(A2)
N$30: LED_5V1.K(C) R19.1
N$32: LED_5V2.K(C) R21.1
N$34: LED_5V4.K(C) R23.1
N$36: LED_5V5.K(C) R25.1
POWER_GND_1: AMP_1.P_4(POWER_GND_1) AMP_1.P_5(POWER_GND_2) SV16.2 U$1.P$4
POWER_GND_2: AMP_2.P_4(POWER_GND_1) AMP_2.P_5(POWER_GND_2) SV11.2 U$2.P$4
POWER_GND_3: AMP_3.P_4(POWER_GND_1) AMP_3.P_5(POWER_GND_2) SV10.2 U$3.P$4
POWER_GND_4: AMP_4.P_4(POWER_GND_1) AMP_4.P_5(POWER_GND_2) SV17.2 U$4.P$4
POWER_GND_5: AMP_5.P_4(POWER_GND_1) AMP_5.P_5(POWER_GND_2) SV18.2 U$5.P$4
V_HIGH_1: AMP_1.P_1(V_HIGH_1) AMP_1.P_2(V_HIGH_2) U$1.P$1
V_HIGH_2: AMP_2.P_1(V_HIGH_1) AMP_2.P_2(V_HIGH_2) U$2.P$1
V_HIGH_3: AMP_3.P_1(V_HIGH_1) AMP_3.P_2(V_HIGH_2) U$3.P$1
V_HIGH_4 [supply]: AMP_4.P_1(V_HIGH_1) AMP_4.P_2(V_HIGH_2) U$4.P$1
V_HIGH_5: AMP_5.P_1(V_HIGH_1) AMP_5.P_2(V_HIGH_2) U$5.P$1
Unconnected: AMP_1.P_3(NC(KEY)) AMP_1.P_6(MOTOR_C_1) AMP_1.P_7(MOTOR_C_2) AMP_1.S_6(+V_HALL_OUT) AMP_1.S_8(HALL_1) AMP_1.S_9(HALL_2) AMP_1.S_10(HALL_3) AMP_1.S_11(CURRENT_REF_OUT) AMP_1.S_13(NC_1) AMP_1.S_14(NC_2) AMP_1.S_15(NC_3) AMP_1.S_16(NC_4) AMP_2.P_3(NC(KEY)) AMP_2.P_6(MOTOR_C_1) AMP_2.P_7(MOTOR_C_2) AMP_2.S_6(+V_HALL_OUT) AMP_2.S_8(HALL_1) AMP_2.S_9(HALL_2) AMP_2.S_10(HALL_3) AMP_2.S_11(CURRENT_REF_OUT) AMP_2.S_13(NC_1) AMP_2.S_14(NC_2) AMP_2.S_15(NC_3) AMP_2.S_16(NC_4) AMP_3.P_3(NC(KEY)) AMP_3.P_6(MOTOR_C_1) AMP_3.P_7(MOTOR_C_2) AMP_3.S_6(+V_HALL_OUT) AMP_3.S_8(HALL_1) AMP_3.S_9(HALL_2) AMP_3.S_10(HALL_3) AMP_3.S_11(CURRENT_REF_OUT) AMP_3.S_13(NC_1) AMP_3.S_14(NC_2) AMP_3.S_15(NC_3) AMP_3.S_16(NC_4) AMP_4.P_3(NC(KEY)) AMP_4.P_6(MOTOR_C_1) AMP_4.P_7(MOTOR_C_2) AMP_4.S_6(+V_HALL_OUT) AMP_4.S_8(HALL_1) AMP_4.S_9(HALL_2) AMP_4.S_10(HALL_3) AMP_4.S_11(CURRENT_REF_OUT) AMP_4.S_13(NC_1) AMP_4.S_14(NC_2) AMP_4.S_15(NC_3) AMP_4.S_16(NC_4) AMP_5.P_3(NC(KEY)) AMP_5.P_6(MOTOR_C_1) AMP_5.P_7(MOTOR_C_2) AMP_5.S_6(+V_HALL_OUT) AMP_5.S_8(HALL_1) AMP_5.S_9(HALL_2) AMP_5.S_10(HALL_3) AMP_5.S_11(CURRENT_REF_OUT) AMP_5.S_13(NC_1) AMP_5.S_14(NC_2) AMP_5.S_15(NC_3) AMP_5.S_16(NC_4) IC1.11(Y8) IC1.12(Y7) IC3.11(Y8) IC3.12(Y7) SV1.6(+V_HALL_OUT) SV1.8(HALL_1) SV1.9(HALL_2) SV1.10(HALL_3) SV1.11(CURRENT_REF_OUT) SV1.13(NC_1) SV1.14(NC_2) SV1.15(NC_3) SV1.16(NC_4) SV2.6(+V_HALL_OUT) SV2.8(HALL_1) SV2.9(HALL_2) SV2.10(HALL_3) SV2.11(CURRENT_REF_OUT) SV2.13(NC_1) SV2.14(NC_2) SV2.15(NC_3) SV2.16(NC_4) SV3.6(+V_HALL_OUT) SV3.8(HALL_1) SV3.9(HALL_2) SV3.10(HALL_3) SV3.11(CURRENT_REF_OUT) SV3.13(NC_1) SV3.14(NC_2) SV3.15(NC_3) SV3.16(NC_4) SV4.6(+V_HALL_OUT) SV4.8(HALL_1) SV4.9(HALL_2) SV4.10(HALL_3) SV4.11(CURRENT_REF_OUT) SV4.13(NC_1) SV4.14(NC_2) SV4.15(NC_3) SV4.16(NC_4) SV5.6(+V_HALL_OUT) SV5.8(HALL_1) SV5.9(HALL_2) SV5.10(HALL_3) SV5.11(CURRENT_REF_OUT) SV5.13(NC_1) SV5.14(NC_2) SV5.15(NC_3) SV5.16(NC_4)

## Library data of the parts
28027_DIR 28027_PWM DIR PWM = Robot_Arm:MA06-1: PIN HEADER; OC_FARNELL: unknown; OC_NEWARK: unknown
28027_JTAG 28335_JTAG = con-lstb:MA07-2: PIN HEADER
28335_DIR 28335_PWM AMP_CURRENT SV12-SV15 UART_SENSOR = Robot_Arm:MA05-1: PIN HEADER; OC_FARNELL: unknown; OC_NEWARK: unknown
28335_ENC ADC_I2C JOINT_INDEX SV6 SV19 SV20 SV28 = con-lstb:MA05-2: PIN HEADER
ADCA ADCB = con-lstb:MA06-2: PIN HEADER
AMP_1-AMP_5 = Robot_Arm:AZBDC12A8
BREAK_CTRL = Robot_Arm:MA03-1: PIN HEADER; OC_FARNELL: unknown; OC_NEWARK: unknown
BREAK_POWER = Robot_Arm:BREAK_POWER_CON
C1 = rcl:CPOL-US: POLARIZED CAPACITOR, American symbol
C2-C39 C41-C43 C46 = rcl:C-US: CAPACITOR, American symbol
CAN = con-lstb:MA03-2: PIN HEADER
D_LED1-D_LED3 LED_5V LED_5V1 LED_5V2 LED_5V4 LED_5V5 LED_RX1 LED_TX1 P_LED1-P_LED3 USB_PWR1 = led:LED: LED
IC1 IC3 = 74xx-us:74*541: Octal BUFFER and LINE DRIVER, 3-state
IC2 = 74xx-us:74*3384: 10-bit FET bus switches with level shifting
INHIBIT_LED INHIBIT_SWITCH ON_LED SV7-SV11 SV16-SV18 = Robot_Arm:MA02-1: PIN HEADER; OC_FARNELL: unknown; OC_NEWARK: unknown
J4 = POWER-IN:JACK-PMS
J7 = custom:F28335_CONTROLCARD
L2 = rcl:L-US: INDUCTOR, American symbol
PINS = Robot_Arm:MA06-2: PIN HEADER; OC_FARNELL: unknown; OC_NEWARK: unknown
Q3 Q4 = transistor-npn:TIP122*: NPN Darlington Transistor
QG1 = crystal:XO-: CRYSTAL
R1-R33 R35-R38 = rcl:R-US_: RESISTOR, American symbol
SPI = con-lstb:MA04-2: PIN HEADER
SV1-SV5 = Robot_Arm:AMP_HEADER: PIN HEADER; OC_FARNELL: unknown; OC_NEWARK: unknown
U1 = custom:TLV1117-ADJ
U2 U4 = custom:MAX3232IDWR
U3 = Robot_Arm:TMS320F28027DAS
U6 = ftdichip-3:FT232RL: USB UART 4th Generation USB UART (USB <-> Serial) Controller
U7-U10 U12-U14 = custom2:LS7366R
U16 = custom4:OPA4830
U$1-U$5 = Robot_Arm:AMP_CON
X2 = con-usb-3:USB: USB Connectors
X4 = con-subd:F25HP: SUB-D; OC_FARNELL: unknown; OC_NEWARK: unknown

## Net classes
0 default: width 0.203 mm, drill 0.381 mm, clearance 0.203 mm
1 supply: width 0.635 mm, drill 0.381 mm, clearance 0.203 mm